# Altium schematic sheet main.SchDoc
size A4
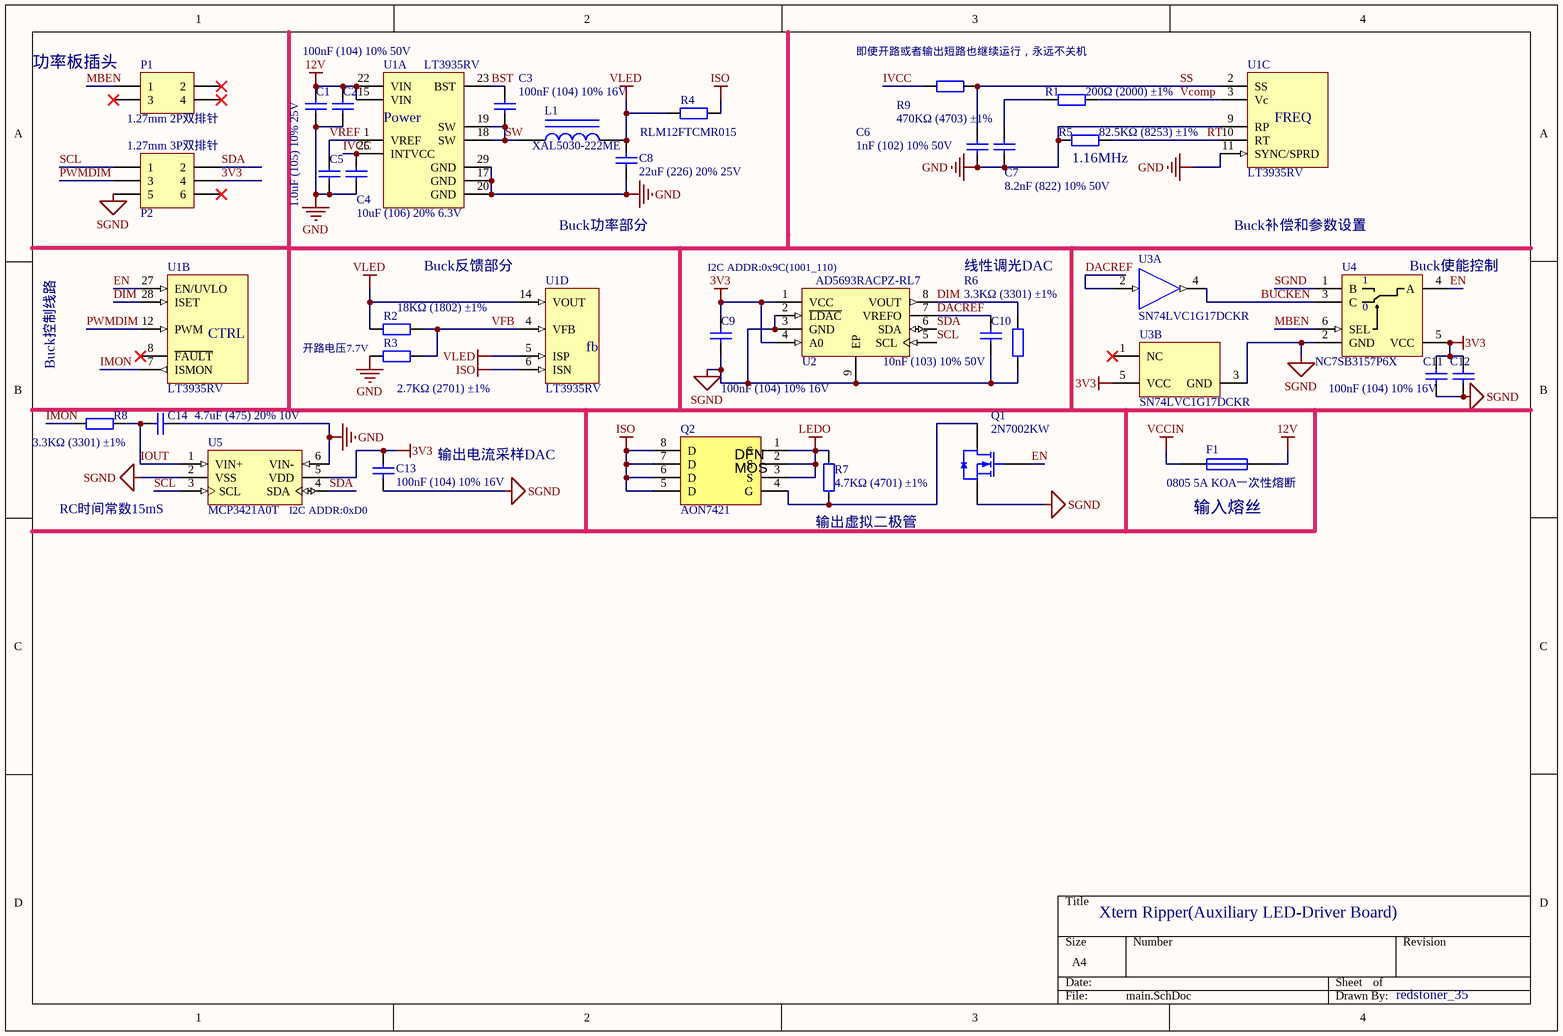
[diagram p0: main.SchDoc]

## Parts
C1  100nF (104) 10% 50V  [0603_C]  (value not drawn)
C2  100nF (104) 10% 50V  [0603_C]
C3  100nF (104) 10% 16V  [0402_C]
C4  10uF (106) 20% 6.3V  [0402_C]
C5  1.0uF (105) 10% 25V  [0402_C]
C6  1nF (102) 10% 50V  [0402_C]
C7  8.2nF (822) 10% 50V  [0402_C]
C8  22uF (226) 20% 25V  [0805_C]
C9  100nF (104) 10% 16V  [0402_C]
C10  10nF (103) 10% 50V  [0402_C]
C11  100nF (104) 10% 16V  [0402_C]
C12  100nF (104) 10% 16V  [0402_C]  (value not drawn)
C13  100nF (104) 10% 16V  [0402_C]
C14  4.7uF (475) 20% 10V  [0402_C]
F1  0805 5A KOA一次性熔断  [FU 0805]
L1  XAL5030-222ME  [FEXL0520A-***M]
P1  1.27mm 2P双排针  [MHDR2X2]
P2  1.27mm 3P双排针  [MHDR2X3]
Q1  2N7002KW  [SC70-3]
Q2  AON7421  [DFN-8_L3.0-W3.0-P0.65-BL]
R1  200Ω (2000) ±1%  [0402_R]
R2  18KΩ (1802) ±1%  [0402_R]
R3  2.7KΩ (2701) ±1%  [0402_R]
R4  RLM12FTCMR015  [1206_R]
R5  82.5KΩ (8253) ±1%  [0402_R]
R6  3.3KΩ (3301) ±1%  [0402_R]
R7  4.7KΩ (4701) ±1%  [0402_R]
R8  3.3KΩ (3301) ±1%  [0402_R]
R9  470KΩ (4703) ±1%  [0402_R]
U1  LT3935RV  [LQFN-28]  (parts A,B,C,D of 4)
U2  AD5693RACPZ-RL7  [LFCSP-8-10]
U3  SN74LVC1G17DCKR  [DCK0005A_N]  (parts A,B of 2)
U4  NC7SB3157P6X  [SC70-6]
U5  MCP3421A0T  [SOT95P245X110-6N]

## Nets
3V3: C9.2 C11.2 C12.2 C13.2 P2.4 U2.1(VCC) U2.4(A0) U3.5(VCC) U4.5(VCC) U5.5(VDD)
12V: C1.2 C2.2 F1.2 U1.15(VIN) U1.22(VIN)
GND: C1.1 C2.1 C4.1 C5.1 C6.1 C7.1 C8.1 C14.2 R3.2 R5.1 U1.9(RP) U1.11(SYNC/SPRD) U1.17(GND) U1.20(GND) U1.29(GND) U5.6(VIN-)
ISO: Q2.5(D) Q2.6(D) Q2.7(D) Q2.8(D) R4.2 U1.6(ISN)
LEDO: Q2.1(S) Q2.2(S) Q2.3(S) R7.2
SGND: C9.1 C10.1 C11.1 C12.1 C13.1 P2.5 Q1.2(S) R6.1 U2.2(~{LDAC}) U2.3(GND) U2.9(EP) U3.3(GND) U4.1(B) U4.2(GND) U5.2(VSS)
VCCIN: F1.1
VLED: C8.2 L1.2 R2.1 R4.1 U1.5(ISP) U1.14(VOUT)
BST: C3.2 U1.23(BST)
BUCKEN: U3.4(Y) U4.3(C)
DACREF: C10.2 U2.7(VREFO) U3.2(A)
DIM: R6.2 U1.28(ISET) U2.8(VOUT)
EN: Q1.1(G) U1.27(EN/UVLO) U4.4(A)
IMON: R8.1 U1.7(ISMON)
IOUT: C14.1 R8.2 U5.1(VIN+)
IVCC: C4.2 R9.1 U1.25(INTVCC)
MBEN: P1.1 U4.6(SEL)
PWMDIM: P2.3 U1.12(PWM)
RT: R5.2 U1.10(RT)
SCL: P2.1 U2.5(SCL) U5.3(SCL)
SDA: P2.2 U2.6(SDA) U5.4(SDA)
SS: C6.2 R9.2 U1.2(SS)
SW: C3.1 L1.1 U1.18(SW) U1.19(SW)
Vcomp: R1.2 U1.3(Vc)
VFB: R2.2 R3.1 U1.4(VFB)
VREF: C5.2 U1.1(VREF)
NetC7_2: C7.2 R1.1
NetQ1_3: Q1.3(D) Q2.4(G) R7.1

Not connected (* = marked no-connect by the designer): P1 2* 3* 4*; P2 6*; U1 8(~{FAULT})*; U3 1(NC)*

## Notes on the sheet
- 功率板插头
- (near R9) 即使开路或者输出短路也继续运行，永远不关机
- (near R5) 1.16MHz
- Buck功率部分
- Buck补偿和参数设置
- Buck反馈部分
- (near U2) I2C ADDR:0x9C(1001_110)
- 线性调光DAC
- (near U4) Buck使能控制
- Buck控制线路
- 开路电压7.7V
- RC时间常数15mS
- (near U5) I2C ADDR:0xD0
- 输出电流采样DAC
- (near F1) 输入熔丝
- (near R7) 输出虚拟二极管
- Xtern Ripper(Auxiliary LED-Driver Board)
- redstoner_35
- (in symbol LT3935RV, part A) Power
- (in symbol LT3935RV, part B) CTRL
- (in symbol LT3935RV, part C) FREQ
- (in symbol LT3935RV, part D) fb
- (in symbol NC7SB3157P6X) 0
- (in symbol SON/DFN5x6 MOS) DFN; MOS

## Library data of the parts
C1 C2 = 0603 100nF (104) 10% 50V: 贴片电容; ComponentLink1Description: 供应商链接; ComponentLink1URL: http://www.szlcsc.com/product/details_15331.html; Package: 0603; Supplier: LC; SuppliersPartNumber: C14663
C3 C9 C11-C13 = 0402 100nF (104) 10% 16V: 贴片电容; ComponentLink1Description: 供应商链接; ComponentLink1URL: http://www.szlcsc.com/product/details_1877.html; Package: 0402; Supplier: LC; SuppliersPartNumber: C1525
C4 = 0402 10uF (106) 20% 6.3V: 贴片电容; ComponentLink1Description: 供应商链接; ComponentLink1URL: http://www.szlcsc.com/product/details_16204.html; Package: 0402; Supplier: LC; SuppliersPartNumber: C15525
C5 = 0402 1.0uF (105) 10% 25V: 贴片电容; ComponentLink1Description: 供应商链接; ComponentLink1URL: http://www.szlcsc.com/product/details_53938.html; Package: 0402; Supplier: LC; SuppliersPartNumber: C52923
C6 = 0402 1nF (102) 10% 50V: 贴片电容; ComponentLink1Description: 供应商链接; ComponentLink1URL: http://www.szlcsc.com/product/details_1875.html; Package: 0402; Supplier: LC; SuppliersPartNumber: C1523
C7 = 0402 2.2nF (222) 10% 50V: 贴片电容; ComponentLink1Description: 供应商链接; ComponentLink1URL: http://www.szlcsc.com/product/details_1883.html; Package: 0402; Supplier: LC; SuppliersPartNumber: C1531
C8 = 0805 22uF (226) 20% 25V: 贴片电容; ComponentLink1Description: 供应商链接; ComponentLink1URL: http://www.szlcsc.com/product/details_46786.html; Package: 0805; Supplier: LC; SuppliersPartNumber: C45783
C10 = 0402 10nF (103) 10% 50V: 贴片电容; ComponentLink1Description: 供应商链接; ComponentLink1URL: http://www.szlcsc.com/product/details_15869.html; Package: 0402; Supplier: LC; SuppliersPartNumber: C15195
C14 = 0402 4.7uF (475) 20% 10V: 贴片电容; ComponentLink1Description: 供应商链接; ComponentLink1URL: http://www.szlcsc.com/product/details_24469.html; Package: 0402; Supplier: LC; SuppliersPartNumber: C23733
F1 = Fuse 1: Fuse; Published: 8-Jun-2000; LatestRevisionDate: 17-Jul-2002; LatestRevisionNote: Re-released for DXP Platform.; PackageReference: PIN-W2/E2.8; Publisher: Altium Limited; PackageDescription: Thru-Hole; 2 Leads
L1 = Inductor Iron: Magnetic-Core Inductor; Value: 1uH; Published: 24-Mar-1999; LatestRevisionDate: 17-Jul-2002; LatestRevisionNote: Re-released for DXP Platform.; PackageReference: AXIAL-0.9; Publisher: Altium Limited; PackageDescription: Axial Device, Thru-Hole; 2 Leads; 0.9 in Pin Spacing
P1 = MHDR2X2: Header, 2-Pin, Dual row; LatestRevisionDate: 17-Jul-2002; LatestRevisionNote: Re-released for DXP Platform.; Publisher: Altium Limited
P2 = MHDR2X3: Header, 3-Pin, Dual row; LatestRevisionDate: 17-Jul-2002; LatestRevisionNote: Re-released for DXP Platform.; Publisher: Altium Limited
Q1 = 2N7002 7002: MOS(场效应管); ComponentLink1Description: 供应商链接; ComponentLink1URL: http://www.szlcsc.com/product/details_9040.html; Package: SOT-323; Supplier: LC; SuppliersPartNumber: C???????
Q2 = SON/DFN5x6 MOS: PDFN3x3 -20V -50A 5.8mΩ P-Ch MOSFET
R1-R3 = 0402 10KΩ (1002) 1%: 贴片电阻; ComponentLink1Description: 供应商链接; ComponentLink1URL: http://www.szlcsc.com/product/details_26487.html; Package: 0402; Supplier: LC
  R1: SuppliersPartNumber: C????
  R2: SuppliersPartNumber: C??????
  R3: SuppliersPartNumber: C????????
R4 = 1206 0Ω (0R0) 1%: 贴片合金检流电阻 15mΩ (R015) ±1% 1206 1W; ComponentLink1Description: 供应商链接; ComponentLink1URL: http://www.szlcsc.com/product/details_18576.html; Package: 1206; Supplier: LC; SuppliersPartNumber: C????????????; Notepad: RLM12FTCMR015
R5 = 0402 1KΩ (1001) 1%: 贴片电阻; ComponentLink1Description: 供应商链接; ComponentLink1URL: http://www.szlcsc.com/product/details_12256.html; Package: 0402; Supplier: LC; SuppliersPartNumber: C????????
R6 R8 = 0402 3.3KΩ (3301) 1%: 贴片电阻; ComponentLink1Description: 供应商链接; ComponentLink1URL: http://www.szlcsc.com/product/details_26633.html; Package: 0402; Supplier: LC; SuppliersPartNumber: C25890
R7 = 0402 4.7KΩ (4701) 1%: 贴片电阻; ComponentLink1Description: 供应商链接; ComponentLink1URL: http://www.szlcsc.com/product/details_26643.html; Package: 0402; Supplier: LC; SuppliersPartNumber: C25900
R9 = 0402 470KΩ (4703) 1%: 贴片电阻; ComponentLink1Description: 供应商链接; ComponentLink1URL: http://www.szlcsc.com/product/details_26533.html; Package: 0402; Supplier: LC; SuppliersPartNumber: C25790
U1 = LT3935RV: 36V 4A Synchronous Buck LED Driver
U2 = AD5693RACPZ-RL7: 16bit I2C Nano DAC with 2.5V internal Ref in 2x2mm SON
U3 = SN74LVC1G17DCKR: Single Schmitt-Trigger Buffer, DCK0005A, LARGE T&R; Manufacturer: Texas Instruments; VCC(Min)(V): 1.65; VCC(Max)(V): 5.5; Output Type: CMOS; ICC @ Nom Voltage(Max)(mA): 0.01; Input Type: CMOS/TTL; Bits(#): 1; F @ Nom Voltage(Max)(Mhz): 150; Rating: Catalog; Technology Family: LVC; Voltage(Nom)(V): 1.8,2.5,3.3,5; Schmitt Trigger: Yes; Output Drive (IOL/IOH)(Max)(mA): 32/-32; tpd @ Nom Voltage(Max)(ns): 11,6.5,5.5,5; Logic: True; Sub-Family: Non-Inverting Buffer/Driver; 3-State Output: No; DatasheetVersion: SCES351V; PackageReference: DCK0005A; Supplier 1: Mouser; Supplier Part Number 1: 595-SN74LVC1G17DCKR; Supplier 2: Digi-Key; Supplier Part Number 2: 296-11934-2-ND; Supplier 3: Digi-Key; Supplier Part Number 3: 296-11934-1-ND; Supplier 4: Digi-Key; Supplier Part Number 4: 296-11934-6-ND; Generic Part Number: SN74LVC1G17; Operating Temperature Range(C): -40 to 125,-40 to 85; PartNumber: SN74LVC1G17DCKR; ComponentLink1Description: Manufacturer URL; ComponentLink1URL: http://www.ti.com/; ComponentLink2Description: Datasheet; ComponentLink2URL: http://www.ti.com/lit/ds/symlink/sn74lvc1g17.pdf
U4 = NC7SB3157P6X: Low-Voltage Analog Switch SPDT,1.8-5V Power
U5 = MCP3421: I2C差分输入ADC，18位 240SPS